# EAGLE board hw_LM (EAGLE 7.6.0), part 1 of 5
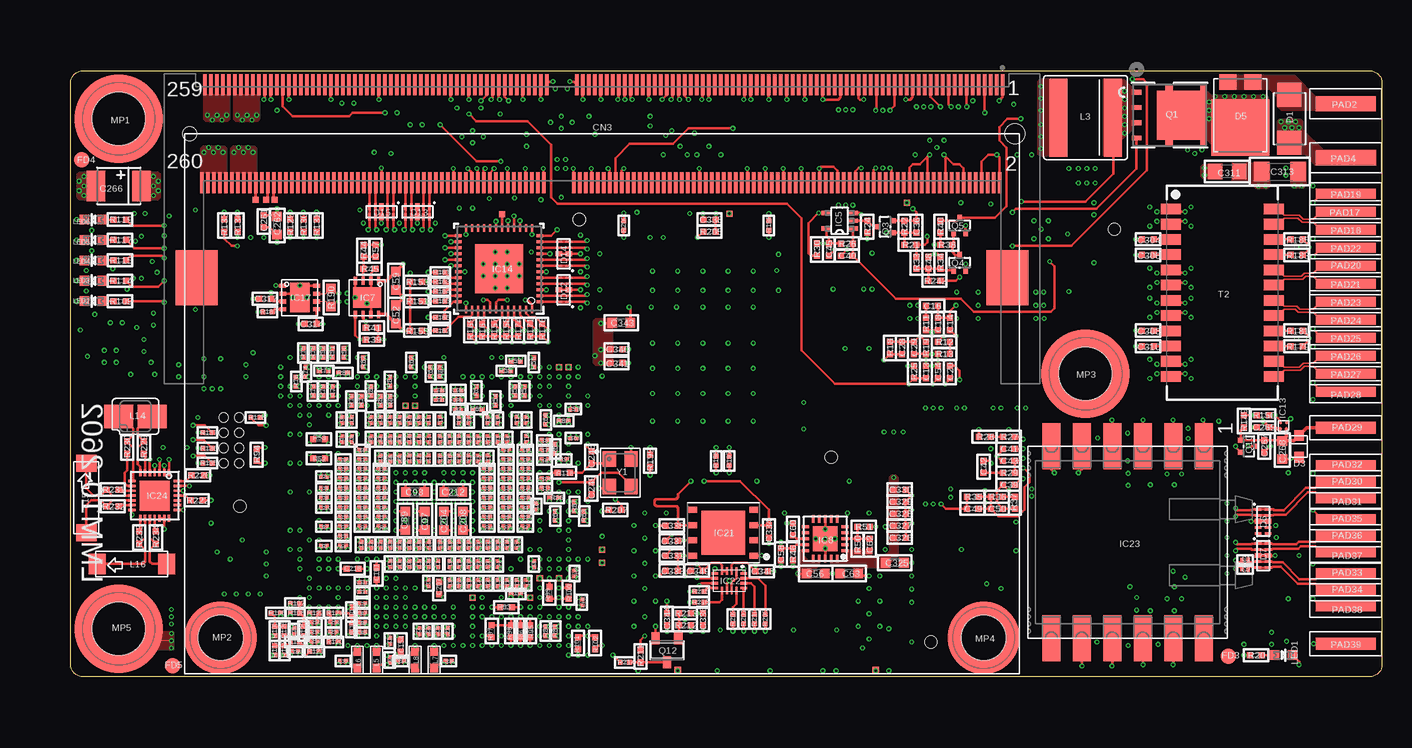
[diagram p13: board, top side]
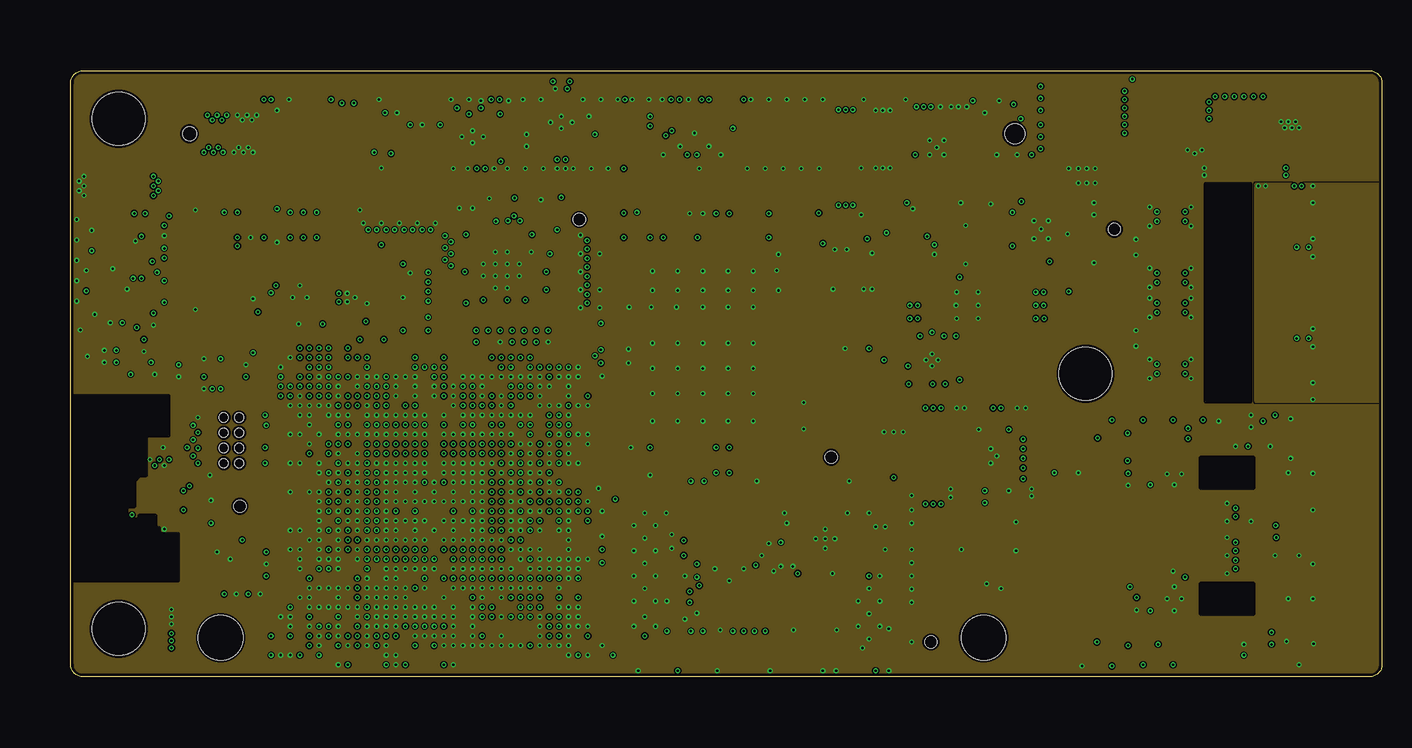
[diagram p14: board, inner layer GND2]
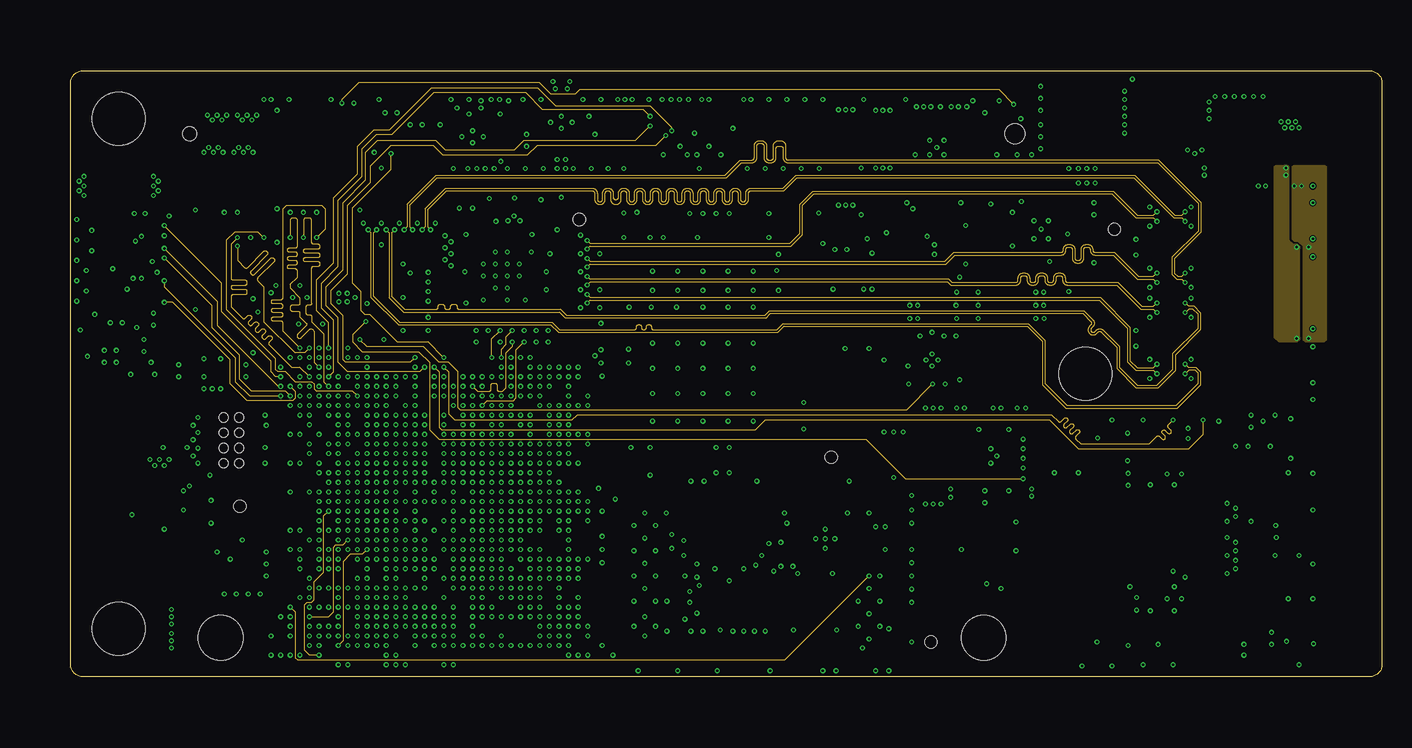
[diagram p15: board, inner layer S3]
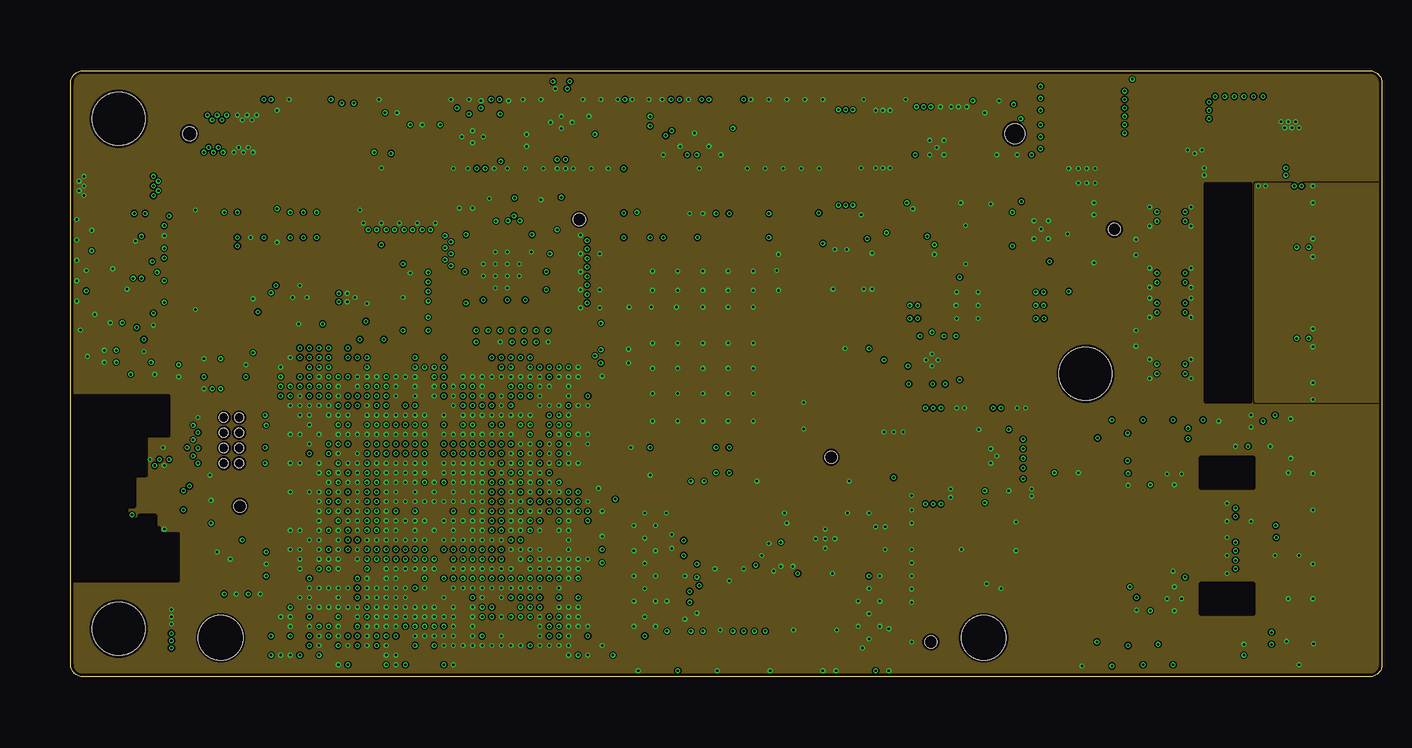
[diagram p16: board, inner layer GND4]
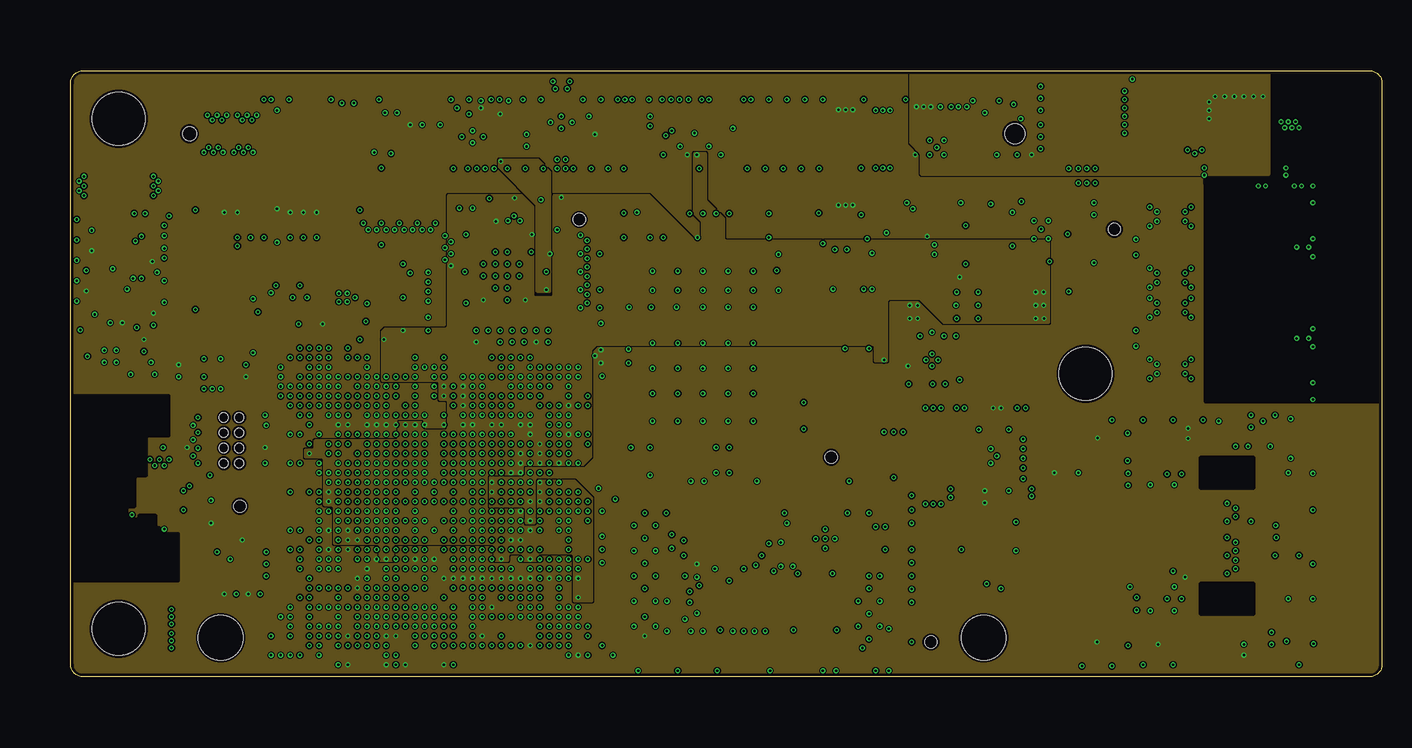
[diagram p17: board, inner layer PWR5]
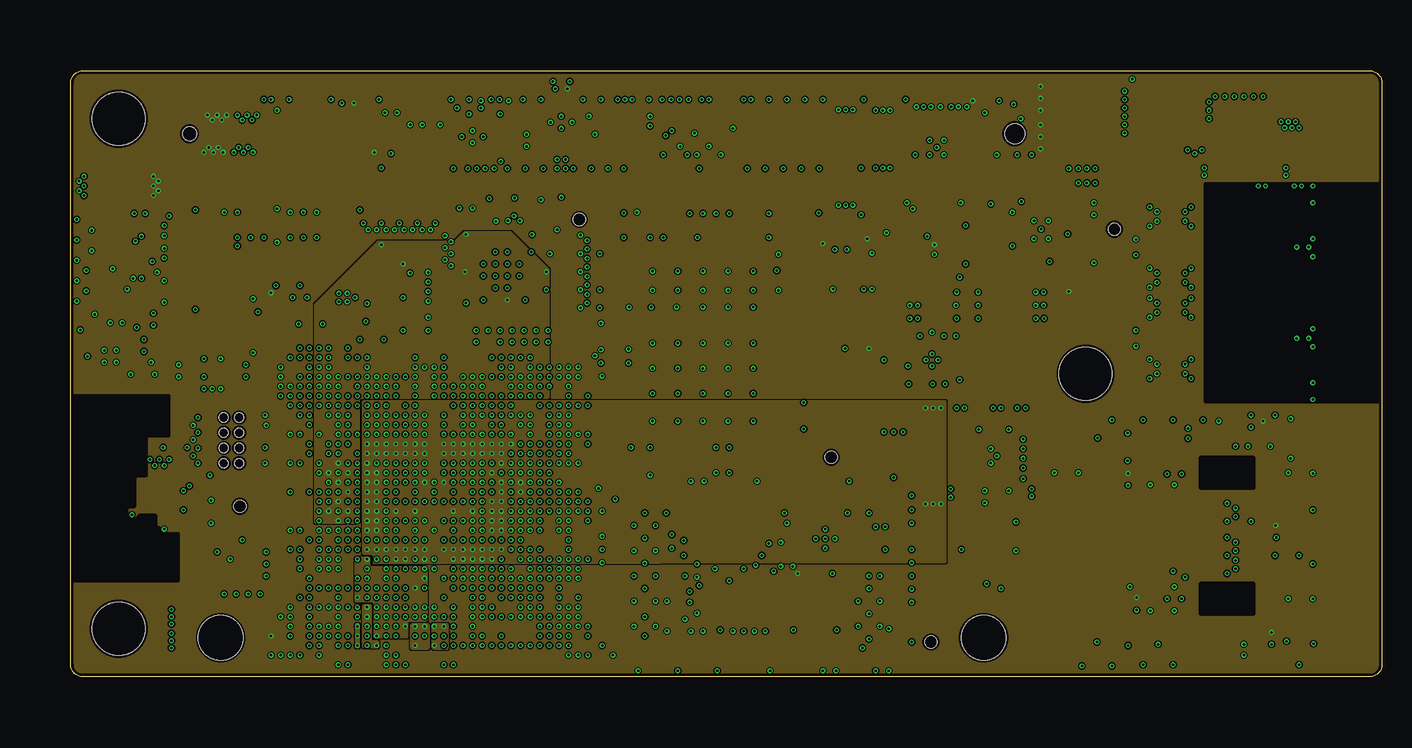
[diagram p18: board, inner layer PWR6]
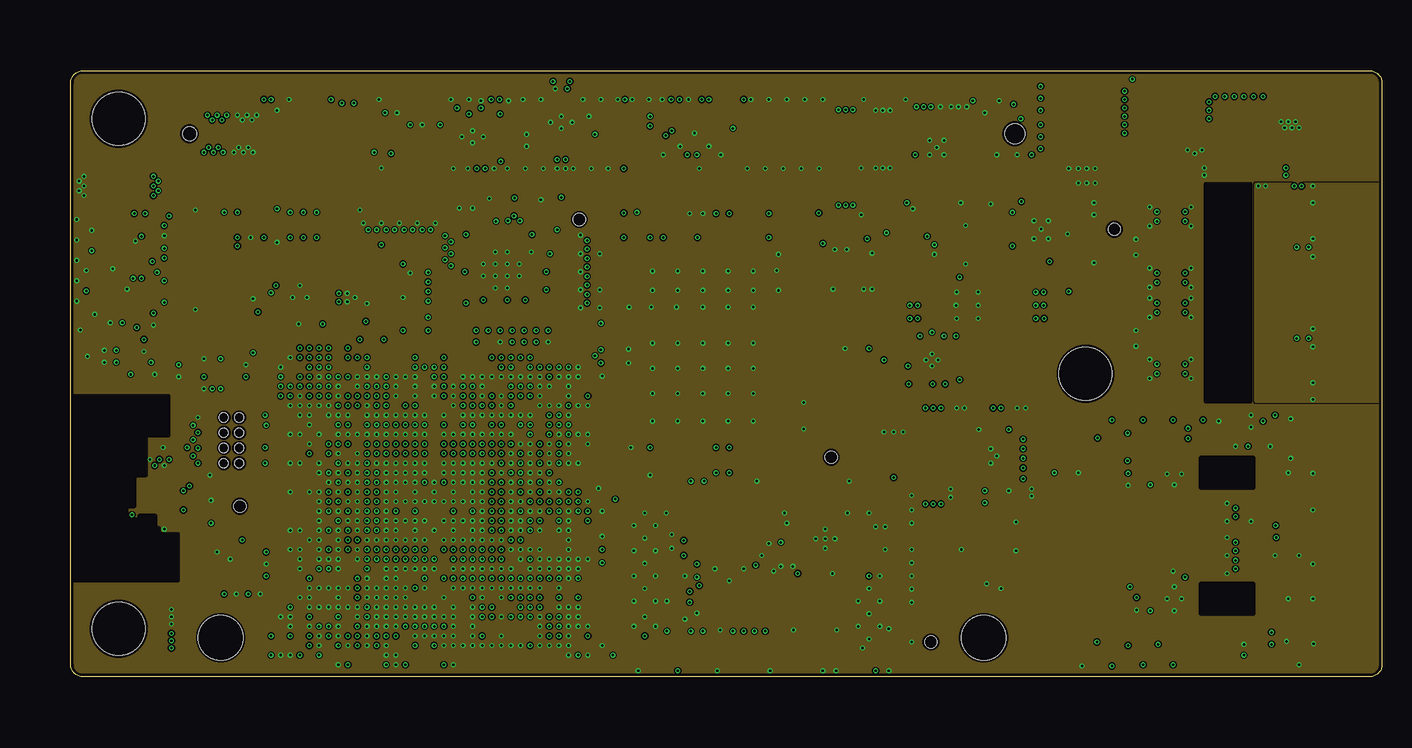
[diagram p19: board, inner layer GND7]
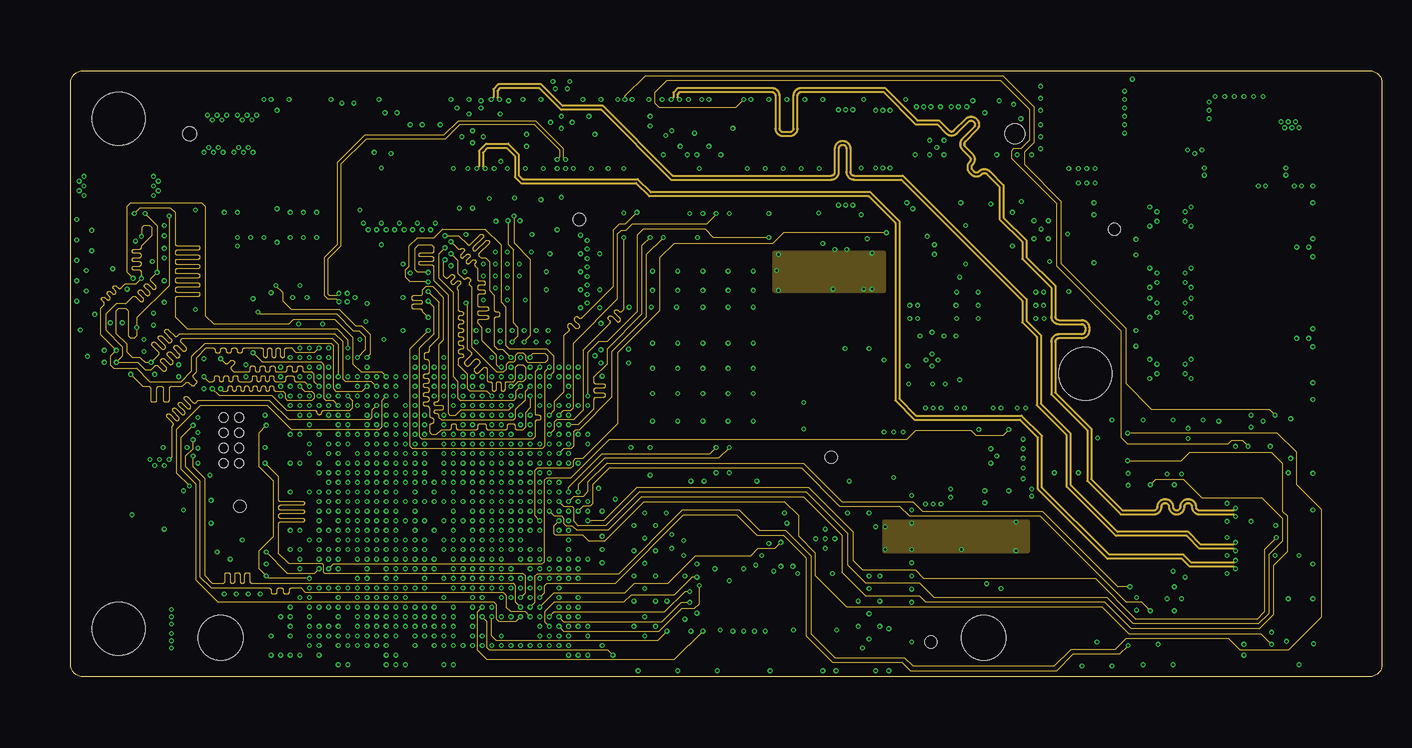
[diagram p20: board, inner layer S8]
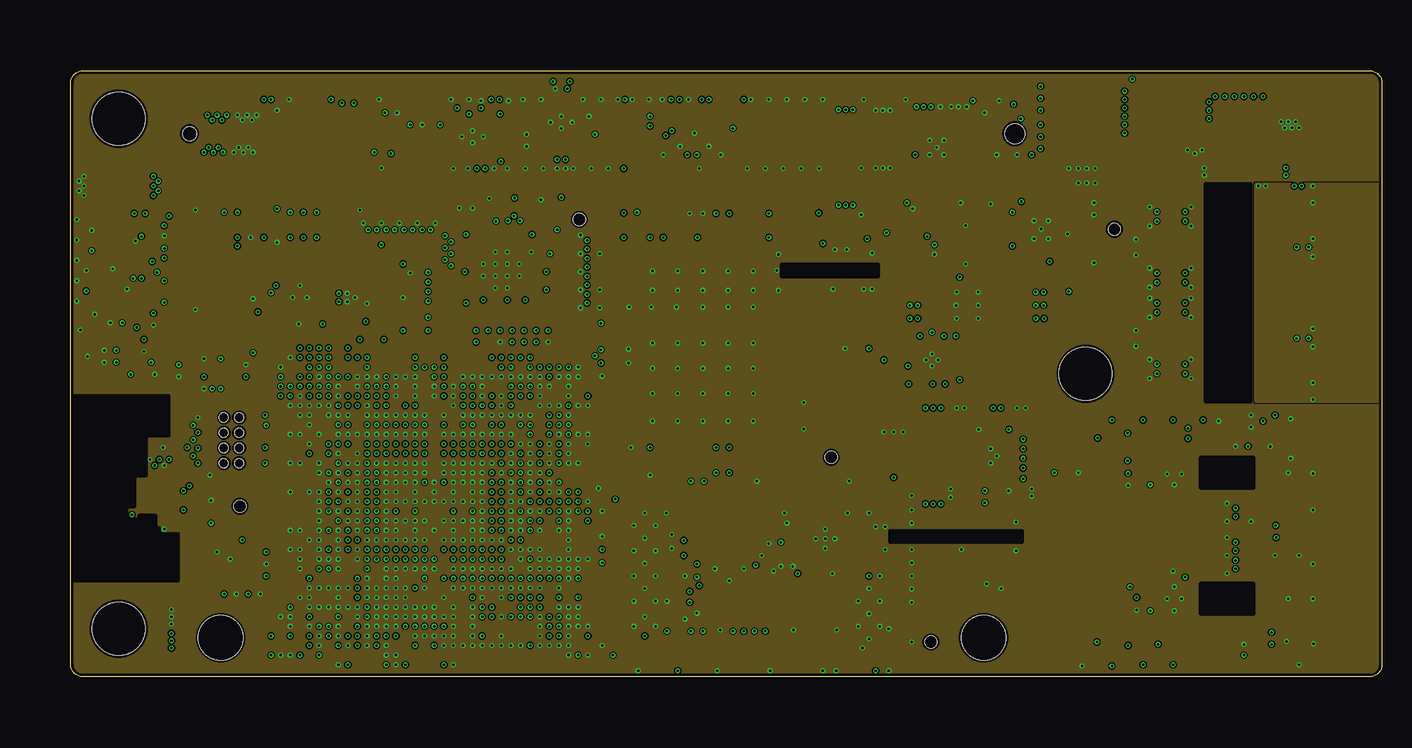
[diagram p21: board, inner layer GND9]
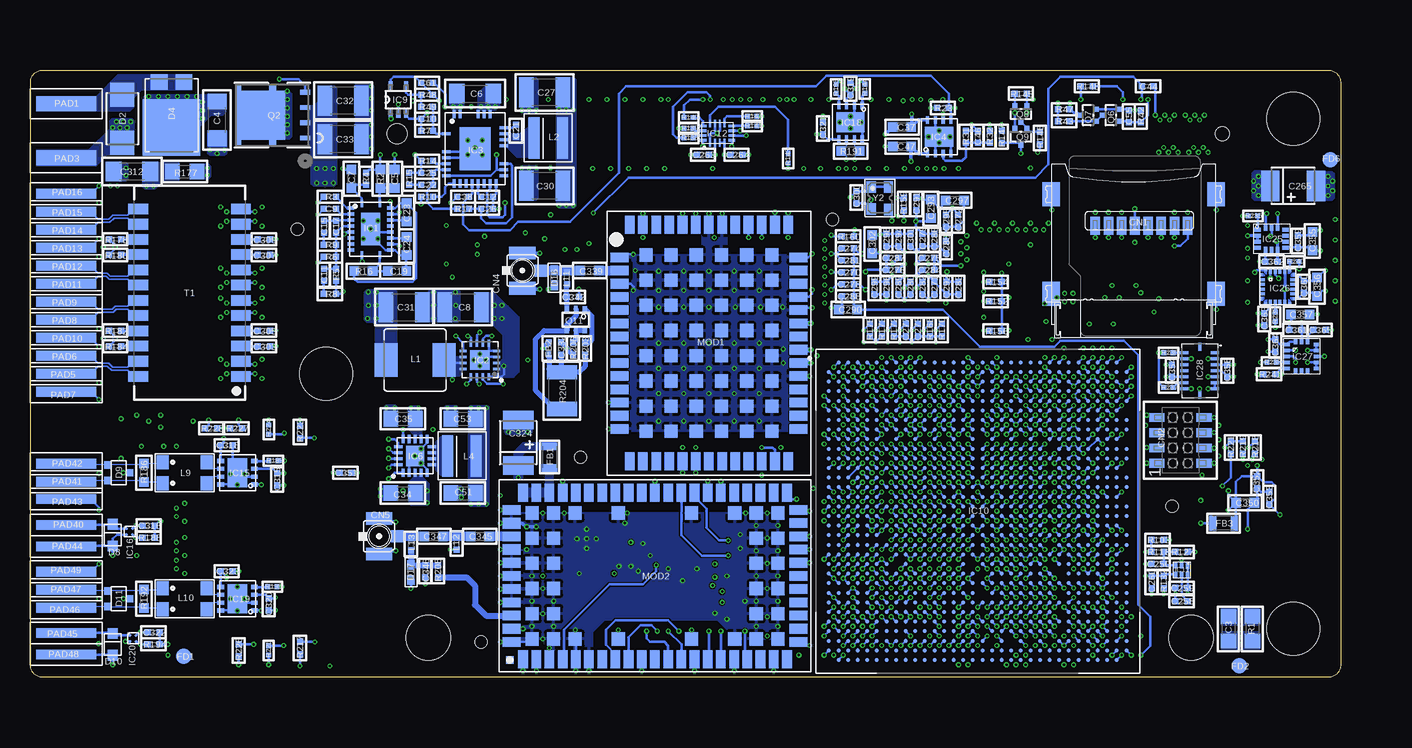
[diagram p22: board, bottom side, seen from below]

Size 109.3 x 50.5 mm. Coordinates in mm from the lower left corner, seen from the top.
Outline: 0,1 0,49.5 arc-90 1,50.5 108.3,50.5 arc-90 109.3,49.5 109.3,1 arc-90 108.3,0 1,0 arc-90 0,1
Copper layers (1+2*3+4*5+12*13+14*15+16): Top 0.017mm / dielectric 0.13mm / GND2 0.017mm / dielectric 10mil / S3 0.017mm / dielectric 0.13mm / GND4 0.017mm / dielectric 0.1mm / PWR5 0.017mm / dielectric 0.13mm / PWR6 0.017mm / dielectric 0.1mm / GND7 0.017mm / dielectric 0.13mm / S8 0.017mm / dielectric 10mil / GND9 0.017mm / dielectric 0.13mm / Bottom 0.017mm
Design rules "hw_LM": minimum track width 0.1mm, minimum drill 0.2mm, track to track 0.1mm, track to pad 0.1mm, pad to pad 0.1mm, via to via 0.1mm, smd to smd 0mil, copper to edge 0.2mm, drill to drill 0.3mm, minimum pad ring 0.15mm, minimum via ring 0.1mm, stop-mask expansion 0.05mm, vias tented up to drill 0.45mm, thermal gap 0.25mm
Net classes: 1 50R: width 0.1 mm, clearance 0.075 mm; 2 100R: width 0.1 mm, clearance 0.12 mm; 3 120R: width 0.1 mm, clearance 0.2 mm; 4 90R: width 0.155 mm, clearance 0.18 mm; 5 50R_INT: width 0.15 mm, clearance 0.075 mm; 6 50R_EXT: width 0.225 mm, clearance 0.1 mm; 7 50R_RF: width 0.8 mm, clearance 0.1 mm; 8 100R_INT: width 0.1 mm, clearance 0.12 mm; 9 100R_EXT: width 0.125 mm, clearance 0.125 mm; 10 90R_INT: width 0.155 mm, clearance 0.18 mm; 11 90R_EXT: width 0.2 mm, clearance 0.18 mm; 12 120R_INT: width 0.1 mm, clearance 0.2 mm; 13 120R_EXT: width 0.1 mm, clearance 0.195 mm
Holes 1 mm at 63.4,18.3 14.1,14.2 42.4,38.1 71.7,2.9 87,37.3

## Footprints (pad centres in the part's own frame; a part is rotated, then mirrored left to right if it is on the bottom)
C0201 = smd 0.3 x 0.4: 1 -0.254,0; 2 0.254,0
C0805 = smd 1.2 x 1.3: 1 -1.016,0; 2 1.016,0
C1206 = smd 1.3 x 1.6: 1 -1.524,0; 2 1.524,0
C0603 = smd 0.8 x 0.8: 1 -0.762,0; 2 0.762,0
C1210 = smd 1.2 x 2.5: 1 -1.524,0; 2 1.524,0
C0402 = smd 0.5 x 0.5: 1 -0.508,0; 2 0.508,0
TE-B-3528 = smd 1.524 x 2.54: + 1.905,0; - -1.905,0
SD-LATCH = smd 0.8 x 1.5: 1 3.3,0; 2 2.2,0; 3 1.1,0; 4 0,0; 5 -1.1,0; 6 -2.2,0; 7 -3.3,0; 8 -4.4,0 | smd 1.45 x 2: G1 6.97,-2.6; G2 6.97,5.7; G3 -6.78,5.7; G4 -6.78,-2.6
CLP-104-02-X-D-BE = smd 0.74 x 1.27: 1 -1.905,1.967; 2 -1.905,-1.967; 3 -0.635,1.967; 4 -0.635,-1.967; 5 0.635,1.967; 6 0.635,-1.967; 7 1.905,1.967; 8 1.905,-1.967 | hole 0.74: -0.635,0.635; 0.635,0.635; 1.905,0.635; -0.635,-0.635; 0.635,-0.635; 1.905,-0.635; -1.905,0.635; -1.905,-0.635
TE_2309409-1 = smd 0.3 x 1.75: 1 33.375,4.1; 2 33.125,-4.1; 3 32.875,4.1; 4 32.625,-4.1; 5 32.375,4.1; 6 32.125,-4.1; 7 31.875,4.1; 8 31.625,-4.1; 9 31.375,4.1; 10 31.125,-4.1; 11 30.875,4.1; 12 30.625,-4.1; 13 30.375,4.1; 14 30.125,-4.1; 15 29.875,4.1; 16 29.625,-4.1; 17 29.375,4.1; 18 29.125,-4.1; 19 28.875,4.1; 20 28.625,-4.1; 21 28.375,4.1; 22 28.125,-4.1; 23 27.875,4.1; 24 27.625,-4.1; 25 27.375,4.1; 26 27.125,-4.1; 27 26.875,4.1; 28 26.625,-4.1; 29 26.375,4.1; 30 26.125,-4.1; 31 25.875,4.1; 32 25.625,-4.1; 33 25.375,4.1; 34 25.125,-4.1; 35 24.875,4.1; 36 24.625,-4.1; 37 24.375,4.1; 38 24.125,-4.1; 39 23.875,4.1; 40 23.625,-4.1; 41 23.375,4.1; 42 23.125,-4.1; 43 22.875,4.1; 44 22.625,-4.1; 45 22.375,4.1; 46 22.125,-4.1; 47 21.875,4.1; 48 21.625,-4.1; 49 21.375,4.1; 50 21.125,-4.1; 51 20.875,4.1; 52 20.625,-4.1; 53 20.375,4.1; 54 20.125,-4.1; 55 19.875,4.1; 56 19.625,-4.1; 57 19.375,4.1; 58 19.125,-4.1; 59 18.875,4.1; 60 18.625,-4.1; 61 18.375,4.1; 62 18.125,-4.1; 63 17.875,4.1; 64 17.625,-4.1; 65 17.375,4.1; 66 17.125,-4.1; 67 16.875,4.1; 68 16.625,-4.1; 69 16.375,4.1; 70 16.125,-4.1; 71 15.875,4.1; 72 15.625,-4.1; 73 15.375,4.1; 74 15.125,-4.1; 75 14.875,4.1; 76 14.625,-4.1; 77 14.375,4.1; 78 14.125,-4.1; 79 13.875,4.1; 80 13.625,-4.1; 81 13.375,4.1; 82 13.125,-4.1; 83 12.875,4.1; 84 12.625,-4.1; 85 12.375,4.1; 86 12.125,-4.1; 87 11.875,4.1; 88 11.625,-4.1; 89 11.375,4.1; 90 11.125,-4.1; 91 10.875,4.1; 92 10.625,-4.1; 93 10.375,4.1; 94 10.125,-4.1; 95 9.875,4.1; 96 9.625,-4.1; 97 9.375,4.1; 98 9.125,-4.1; 99 8.875,4.1; 100 8.625,-4.1; 101 8.375,4.1; 102 8.125,-4.1; 103 7.875,4.1; 104 7.625,-4.1; 105 7.375,4.1; 106 7.125,-4.1; 107 6.875,4.1; 108 6.625,-4.1; 109 6.375,4.1; 110 6.125,-4.1; 111 5.875,4.1; 112 5.625,-4.1; 113 5.375,4.1; 114 5.125,-4.1; 115 4.875,4.1; 116 4.625,-4.1; 117 4.375,4.1; 118 4.125,-4.1; 119 3.875,4.1; 120 3.625,-4.1; 121 3.375,4.1; 122 3.125,-4.1; 123 2.875,4.1; 124 2.625,-4.1; 125 2.375,4.1; 126 2.125,-4.1; 127 1.875,4.1; 128 1.625,-4.1; 129 1.375,4.1; 130 1.125,-4.1; 131 0.875,4.1; 132 0.625,-4.1; 133 0.375,4.1; 134 0.125,-4.1; 135 -0.125,4.1; 136 -0.375,-4.1; 137 -0.625,4.1; 138 -0.875,-4.1; 139 -1.125,4.1; 140 -1.375,-4.1; 141 -1.625,4.1; 142 -1.875,-4.1; 143 -2.125,4.1; 144 -2.375,-4.1; 145 -4.625,4.1; 146 -4.875,-4.1; 147 -5.125,4.1; 148 -5.375,-4.1; 149 -5.625,4.1; 150 -5.875,-4.1; 151 -6.125,4.1; 152 -6.375,-4.1; 153 -6.625,4.1; 154 -6.875,-4.1; 155 -7.125,4.1; 156 -7.375,-4.1; 157 -7.625,4.1; 158 -7.875,-4.1; 159 -8.125,4.1; 160 -8.375,-4.1; 161 -8.625,4.1; 162 -8.875,-4.1; 163 -9.125,4.1; 164 -9.375,-4.1; 165 -9.625,4.1; 166 -9.875,-4.1; 167 -10.125,4.1; 168 -10.375,-4.1; 169 -10.625,4.1; 170 -10.875,-4.1; 171 -11.125,4.1; 172 -11.375,-4.1; 173 -11.625,4.1; 174 -11.875,-4.1; 175 -12.125,4.1; 176 -12.375,-4.1; 177 -12.625,4.1; 178 -12.875,-4.1; 179 -13.125,4.1; 180 -13.375,-4.1; 181 -13.625,4.1; 182 -13.875,-4.1; 183 -14.125,4.1; 184 -14.375,-4.1; 185 -14.625,4.1; 186 -14.875,-4.1; 187 -15.125,4.1; 188 -15.375,-4.1; 189 -15.625,4.1; 190 -15.875,-4.1; 191 -16.125,4.1; 192 -16.375,-4.1; 193 -16.625,4.1; 194 -16.875,-4.1; 195 -17.125,4.1; 196 -17.375,-4.1; 197 -17.625,4.1; 198 -17.875,-4.1; 199 -18.125,4.1; 200 -18.375,-4.1; 201 -18.625,4.1; 202 -18.875,-4.1; 203 -19.125,4.1; 204 -19.375,-4.1; 205 -19.625,4.1; 206 -19.875,-4.1; 207 -20.125,4.1; 208 -20.375,-4.1; 209 -20.625,4.1; 210 -20.875,-4.1; 211 -21.125,4.1; 212 -21.375,-4.1; 213 -21.625,4.1; 214 -21.875,-4.1; 215 -22.125,4.1; 216 -22.375,-4.1; 217 -22.625,4.1; 218 -22.875,-4.1; 219 -23.125,4.1; 220 -23.375,-4.1; 221 -23.625,4.1; 222 -23.875,-4.1; 223 -24.125,4.1; 224 -24.375,-4.1; 225 -24.625,4.1; 226 -24.875,-4.1; 227 -25.125,4.1; 228 -25.375,-4.1; 229 -25.625,4.1; 230 -25.875,-4.1; 231 -26.125,4.1; 232 -26.375,-4.1; 233 -26.625,4.1; 234 -26.875,-4.1; 235 -27.125,4.1; 236 -27.375,-4.1; 237 -27.625,4.1; 238 -27.875,-4.1; 239 -28.125,4.1; 240 -28.375,-4.1; 241 -28.625,4.1; 242 -28.875,-4.1; 243 -29.125,4.1; 244 -29.375,-4.1; 245 -29.625,4.1; 246 -29.875,-4.1; 247 -30.125,4.1; 248 -30.375,-4.1; 249 -30.625,4.1; 250 -30.875,-4.1; 251 -31.125,4.1; 252 -31.375,-4.1; 253 -31.625,4.1; 254 -31.875,-4.1; 255 -32.125,4.1; 256 -32.375,-4.1; 257 -32.625,4.1; 258 -32.875,-4.1; 259 -33.125,4.1; 260 -33.375,-4.1 | smd 3.5 x 4.6: S1 33.8,-12; S2 -33.8,-12 | hole 1.65: 34.4,0 | hole 1.15: -34.4,0
U.FL-R-SMT-1 = smd 1.05 x 2.2: GND1 1.475,0; GND2 -1.475,0 | smd 1 x 1.05: SIG 0,-1.525
SMA_BI = smd 2 x 2: 1 -2,0; 2 2,0
SOD-323 = smd 0.9 x 0.8: A 0.9,0; K -0.9,0
TO-277A-3 = smd 1.4 x 1.27: A1 -1.04,-2.765; A2 1.04,-2.765 | smd 4.8 x 4.72: K 0,1.04
DQA(R-PUSON-N10) = smd 0.2 x 0.565: 1 -1,-0.417; 2 -0.5,-0.417; 4 0.5,-0.417; 5 1,-0.417; 6 1,0.417; 7 0.5,0.417; 9 -0.5,0.417; 10 -1,0.417 | smd 0.4 x 0.565: 3 0,-0.417; 8 0,0.417
SOT323-3 = smd 0.6 x 0.55: 1 -0.65,-0.925; 2 0.65,-0.925; 3 0,0.925
PESD0402-140 = smd 0.8 x 0.6: P$1 -0.625,0; P$2 0.625,0
L0805 = smd 0.6 x 1.25: 1 -0.9,0; 2 0.9,0
L0402 = smd 0.5 x 0.5: 1 -0.508,0; 2 0.508,0
FIDU = smd 1.3 x 1.3: P$1 0,0
VQFN-20 = smd 0.25 x 0.6: 1 -0.75,2.15; 10 -0.75,-2.15; 11 0.75,-2.15; 20 0.75,2.15 | smd 0.6 x 0.25: 2 -1.65,1.75; 3 -1.65,1.25; 4 -1.65,0.75; 5 -1.65,0.25; 6 -1.65,-0.25; 7 -1.65,-0.75; 8 -1.65,-1.25; 9 -1.65,-1.75; 12 1.65,-1.75; 13 1.65,-1.25; 14 1.65,-0.75; 15 1.65,-0.25; 16 1.65,0.25; 17 1.65,0.75; 18 1.65,1.25; 19 1.65,1.75 | smd 1.7 x 2.7: 21 0,0
WQFN-16 = smd 0.6 x 0.24: 1 -1.4,0.75; 2 -1.4,0.25; 3 -1.4,-0.25; 4 -1.4,-0.75; 9 1.4,-0.75; 10 1.4,-0.25; 11 1.4,0.25; 12 1.4,0.75 | smd 0.24 x 0.6: 5 -0.75,-1.4; 6 -0.25,-1.4; 7 0.25,-1.4; 8 0.75,-1.4; 13 0.75,1.4; 14 0.25,1.4; 15 -0.25,1.4; 16 -0.75,1.4 | smd 1.6 x 1.6: EP 0,0
UHE36(26) = smd 0.25 x 0.7: 3 -1.25,-2.4; 6 0.25,-2.4; 7 0.75,-2.4; 8 1.25,-2.4; 9 1.75,-2.4; 10 2.25,-2.4; 19 2.25,2.4; 20 1.75,2.4; 21 1.25,2.4; 24 -0.25,2.4; 25 -0.75,2.4; 26 -1.25,2.4; 27 -1.75,2.4 | smd 0.7 x 0.25: 11 2.9,-1.75; 12 2.9,-1.25; 13 2.9,-0.75; 14 2.9,-0.25; 15 2.9,0.25; 16 2.9,0.75; 17 2.9,1.25; 18 2.9,1.75; 30 -2.9,1.25; 31 -2.9,0.75; 32 -2.9,0.25; 35 -2.9,-1.25; 36 -2.9,-1.75 | smd 3.6 x 2.6: 37 0,0
VSON-8 = smd 0.6 x 0.31: 1 -1.4,0.975; 2 -1.4,0.325; 3 -1.4,-0.325; 4 -1.4,-0.975; 5 1.4,-0.975; 6 1.4,-0.325; 7 1.4,0.325; 8 1.4,0.975 | smd 1.65 x 2.4: 9 0,0
DCK5 = smd 0.85 x 0.35: 1 -1.1,0.65; 2 -1.1,0; 3 -1.1,-0.65; 4 1.1,-0.65; 5 1.1,0.65
LQFN-18 = smd 0.7 x 0.25: 1 -1.4,1; 2 -1.4,0.5; 3 -1.4,0; 4 -1.4,-0.5; 5 -1.4,-1; 10 1.4,-1; 11 1.4,-0.5; 12 1.4,0; 13 1.4,0.5; 14 1.4,1 | smd 0.25 x 0.7: 6 -0.75,-1.4; 7 -0.25,-1.4; 8 0.25,-1.4; 9 0.75,-1.4; 15 0.75,1.4; 16 0.25,1.4; 17 -0.25,1.4; 18 -0.75,1.4 | smd 1.7 x 1.51: 19 0,0
VQFN-20(TEXAS) = smd 0.6 x 0.24: 1 -1.65,1; 2 -1.65,0.5; 3 -1.65,0; 4 -1.65,-0.5; 5 -1.65,-1; 11 1.65,-1; 12 1.65,-0.5; 13 1.65,0; 14 1.65,0.5; 15 1.65,1 | smd 0.24 x 0.6: 6 -1,-1.65; 7 -0.5,-1.65; 8 0,-1.65; 9 0.5,-1.65; 10 1,-1.65; 16 1,1.65; 17 0.5,1.65; 18 0,1.65; 19 -0.5,1.65; 20 -1,1.65 | smd 2.05 x 2.05: 21 0,0
IC_S32E288AACAAMJGR = smd 0.34 x 0.34: A2 -11.6,12.4; A3 -10.8,12.4; A4 -10,12.4; A5 -9.2,12.4; A6 -8.4,12.4; A7 -7.6,12.4; A8 -6.8,12.4; A9 -6,12.4; A10 -5.2,12.4; A11 -4.4,12.4; A12 -3.6,12.4; A13 -2.8,12.4; A14 -2,12.4; A15 -1.2,12.4; A16 -0.4,12.4; A17 0.4,12.4; A18 1.2,12.4; A19 2,12.4; A20 2.8,12.4; A21 3.6,12.4; A22 4.4,12.4; A23 5.2,12.4; A24 6,12.4; A25 6.8,12.4; A26 7.6,12.4; A27 8.4,12.4; A28 9.2,12.4; A29 10,12.4; A30 10.8,12.4; A31 11.6,12.4; AA1 -12.4,-3.6; AA2 -11.6,-3.6; AA3 -10.8,-3.6; AA4 -10,-3.6; AA5 -9.2,-3.6; AA6 -8.4,-3.6; AA8 -6.8,-3.6; AA9 -6,-3.6; AA10 -5.2,-3.6; AA11 -4.4,-3.6; AA12 -3.6,-3.6; AA13 -2.8,-3.6; AA14 -2,-3.6; AA15 -1.2,-3.6; AA16 -0.4,-3.6; AA17 0.4,-3.6; AA18 1.2,-3.6; AA19 2,-3.6; AA20 2.8,-3.6; AA21 3.6,-3.6; AA22 4.4,-3.6; AA23 5.2,-3.6; AA24 6,-3.6; AA25 6.8,-3.6; AA26 7.6,-3.6; AA27 8.4,-3.6; AA28 9.2,-3.6; AA29 10,-3.6; AA30 10.8,-3.6; AA31 11.6,-3.6; AB1 -12.4,-4.4; AB2 -11.6,-4.4; AB3 -10.8,-4.4; AB4 -10,-4.4; AB5 -9.2,-4.4; AB6 -8.4,-4.4; AB7 -7.6,-4.4; AB9 -6,-4.4; AB11 -4.4,-4.4; AB13 -2.8,-4.4; AB15 -1.2,-4.4; AB17 0.4,-4.4; AB18 1.2,-4.4; AB19 2,-4.4; AB20 2.8,-4.4; AB21 3.6,-4.4; AB22 4.4,-4.4; AB23 5.2,-4.4; AB25 6.8,-4.4; AB26 7.6,-4.4; AB27 8.4,-4.4; AB28 9.2,-4.4; AB29 10,-4.4; AB30 10.8,-4.4; AB31 11.6,-4.4; AB32 12.4,-4.4; AC1 -12.4,-5.2; AC2 -11.6,-5.2; AC3 -10.8,-5.2; AC4 -10,-5.2; AC5 -9.2,-5.2; AC6 -8.4,-5.2; AC7 -7.6,-5.2; AC8 -6.8,-5.2; AC9 -6,-5.2; AC10 -5.2,-5.2; AC11 -4.4,-5.2; AC12 -3.6,-5.2; AC13 -2.8,-5.2; AC14 -2,-5.2; AC15 -1.2,-5.2; AC16 -0.4,-5.2; AC18 1.2,-5.2; AC19 2,-5.2; AC20 2.8,-5.2; AC21 3.6,-5.2; AC22 4.4,-5.2; AC23 5.2,-5.2; AC24 6,-5.2; AC26 7.6,-5.2; AC27 8.4,-5.2; AC28 9.2,-5.2; AC29 10,-5.2; AC30 10.8,-5.2; AC31 11.6,-5.2; AC32 12.4,-5.2; AD1 -12.4,-6; AD2 -11.6,-6; AD3 -10.8,-6; AD4 -10,-6; AD5 -9.2,-6; AD6 -8.4,-6; AD7 -7.6,-6; AD8 -6.8,-6; AD9 -6,-6; AD10 -5.2,-6; AD11 -4.4,-6; AD12 -3.6,-6; AD13 -2.8,-6; AD14 -2,-6; AD15 -1.2,-6; AD16 -0.4,-6; AD17 0.4,-6; AD18 1.2,-6; AD19 2,-6; AD20 2.8,-6; AD21 3.6,-6; AD22 4.4,-6; AD23 5.2,-6; AD24 6,-6; AD25 6.8,-6; AD26 7.6,-6; AD27 8.4,-6; AD28 9.2,-6; AD29 10,-6; AD30 10.8,-6; AD31 11.6,-6; AD32 12.4,-6; AE1 -12.4,-6.8; AE2 -11.6,-6.8; AE3 -10.8,-6.8; AE4 -10,-6.8; AE5 -9.2,-6.8; AE6 -8.4,-6.8; AE7 -7.6,-6.8; AE8 -6.8,-6.8; AE9 -6,-6.8; AE10 -5.2,-6.8; AE11 -4.4,-6.8; AE12 -3.6,-6.8; AE13 -2.8,-6.8; AE14 -2,-6.8; AE15 -1.2,-6.8; AE16 -0.4,-6.8; AE18 1.2,-6.8; AE19 2,-6.8; AE20 2.8,-6.8; AE21 3.6,-6.8; AE22 4.4,-6.8; AE23 5.2,-6.8; AE24 6,-6.8; AE26 7.6,-6.8; AE27 8.4,-6.8; AE28 9.2,-6.8; AE29 10,-6.8; AE30 10.8,-6.8; AE31 11.6,-6.8; AE32 12.4,-6.8; AF1 -12.4,-7.6; AF2 -11.6,-7.6; AF3 -10.8,-7.6; AF4 -10,-7.6; AF5 -9.2,-7.6; AF6 -8.4,-7.6; AF7 -7.6,-7.6; AF8 -6.8,-7.6; AF9 -6,-7.6; AF10 -5.2,-7.6; AF11 -4.4,-7.6; AF12 -3.6,-7.6; AF13 -2.8,-7.6; AF14 -2,-7.6; AF15 -1.2,-7.6; AF16 -0.4,-7.6; AF17 0.4,-7.6; AF18 1.2,-7.6; AF19 2,-7.6; AF20 2.8,-7.6; AF21 3.6,-7.6; AF22 4.4,-7.6; AF23 5.2,-7.6; AF24 6,-7.6; AF25 6.8,-7.6; AF26 7.6,-7.6; AF27 8.4,-7.6; AF28 9.2,-7.6; AF29 10,-7.6; AF30 10.8,-7.6; AF31 11.6,-7.6; AF32 12.4,-7.6; AG1 -12.4,-8.4; AG2 -11.6,-8.4; AG3 -10.8,-8.4; AG4 -10,-8.4; AG5 -9.2,-8.4; AG6 -8.4,-8.4; AG7 -7.6,-8.4; AG8 -6.8,-8.4; AG9 -6,-8.4; AG10 -5.2,-8.4; AG11 -4.4,-8.4; AG12 -3.6,-8.4; AG13 -2.8,-8.4; AG14 -2,-8.4; AG15 -1.2,-8.4; AG16 -0.4,-8.4; AG18 1.2,-8.4; AG19 2,-8.4; AG20 2.8,-8.4; AG21 3.6,-8.4; AG22 4.4,-8.4; AG23 5.2,-8.4; AG24 6,-8.4; AG26 7.6,-8.4; AG27 8.4,-8.4; AG28 9.2,-8.4; AG29 10,-8.4; AG30 10.8,-8.4; AG31 11.6,-8.4; AG32 12.4,-8.4; AH1 -12.4,-9.2; AH2 -11.6,-9.2; AH3 -10.8,-9.2; AH4 -10,-9.2; AH5 -9.2,-9.2; AH6 -8.4,-9.2; AH7 -7.6,-9.2; AH8 -6.8,-9.2; AH9 -6,-9.2; AH10 -5.2,-9.2; AH11 -4.4,-9.2; AH12 -3.6,-9.2; AH13 -2.8,-9.2; AH14 -2,-9.2; AH15 -1.2,-9.2; AH16 -0.4,-9.2; AH17 0.4,-9.2; AH18 1.2,-9.2; AH19 2,-9.2; AH20 2.8,-9.2; AH21 3.6,-9.2; AH22 4.4,-9.2; AH23 5.2,-9.2; AH24 6,-9.2; AH25 6.8,-9.2; AH26 7.6,-9.2; AH27 8.4,-9.2; AH28 9.2,-9.2; AH29 10,-9.2; AH30 10.8,-9.2; AH31 11.6,-9.2; AH32 12.4,-9.2; AJ1 -12.4,-10; AJ2 -11.6,-10; AJ3 -10.8,-10; AJ4 -10,-10; AJ5 -9.2,-10; AJ6 -8.4,-10; AJ7 -7.6,-10; AJ8 -6.8,-10; AJ9 -6,-10; AJ10 -5.2,-10; AJ11 -4.4,-10; AJ12 -3.6,-10; AJ13 -2.8,-10; AJ14 -2,-10; AJ15 -1.2,-10; AJ16 -0.4,-10; AJ18 1.2,-10; AJ19 2,-10; AJ20 2.8,-10; AJ21 3.6,-10; AJ22 4.4,-10; AJ23 5.2,-10; AJ24 6,-10; AJ26 7.6,-10; AJ27 8.4,-10; AJ28 9.2,-10; AJ29 10,-10; AJ30 10.8,-10; AJ31 11.6,-10; AJ32 12.4,-10; AK1 -12.4,-10.8; AK2 -11.6,-10.8; AK3 -10.8,-10.8; AK4 -10,-10.8; AK5 -9.2,-10.8; AK6 -8.4,-10.8; AK7 -7.6,-10.8; AK8 -6.8,-10.8; AK9 -6,-10.8; AK10 -5.2,-10.8; AK11 -4.4,-10.8; AK12 -3.6,-10.8; AK13 -2.8,-10.8; AK14 -2,-10.8; AK15 -1.2,-10.8; AK16 -0.4,-10.8; AK17 0.4,-10.8; AK19 2,-10.8; AK21 3.6,-10.8; AK23 5.2,-10.8; AK25 6.8,-10.8; AK26 7.6,-10.8; AK27 8.4,-10.8; AK28 9.2,-10.8; AK29 10,-10.8; AK30 10.8,-10.8; AK31 11.6,-10.8; AK32 12.4,-10.8; AL1 -12.4,-11.6; AL2 -11.6,-11.6; AL3 -10.8,-11.6; AL4 -10,-11.6; AL5 -9.2,-11.6; AL6 -8.4,-11.6; AL7 -7.6,-11.6; AL8 -6.8,-11.6; AL9 -6,-11.6; AL10 -5.2,-11.6; AL11 -4.4,-11.6; AL12 -3.6,-11.6; AL13 -2.8,-11.6; AL14 -2,-11.6; AL15 -1.2,-11.6; AL16 -0.4,-11.6; AL17 0.4,-11.6; AL18 1.2,-11.6; AL19 2,-11.6; AL20 2.8,-11.6; AL21 3.6,-11.6; AL22 4.4,-11.6; AL23 5.2,-11.6; AL24 6,-11.6; AL25 6.8,-11.6; AL26 7.6,-11.6; AL27 8.4,-11.6; AL28 9.2,-11.6; AL29 10,-11.6; AL30 10.8,-11.6; AL31 11.6,-11.6; AL32 12.4,-11.6; AM2 -11.6,-12.4; AM3 -10.8,-12.4; AM4 -10,-12.4; AM5 -9.2,-12.4; AM6 -8.4,-12.4; AM7 -7.6,-12.4; AM8 -6.8,-12.4; AM9 -6,-12.4; AM10 -5.2,-12.4; AM11 -4.4,-12.4; AM12 -3.6,-12.4; AM13 -2.8,-12.4; AM14 -2,-12.4; AM15 -1.2,-12.4; AM16 -0.4,-12.4; AM17 0.4,-12.4; AM18 1.2,-12.4; AM19 2,-12.4; AM20 2.8,-12.4; AM21 3.6,-12.4; AM22 4.4,-12.4; AM23 5.2,-12.4; AM24 6,-12.4; AM25 6.8,-12.4; AM26 7.6,-12.4; AM27 8.4,-12.4; AM28 9.2,-12.4; AM29 10,-12.4; AM30 10.8,-12.4; AM31 11.6,-12.4; B1 -12.4,11.6; B2 -11.6,11.6; B3 -10.8,11.6; B4 -10,11.6; B5 -9.2,11.6; B6 -8.4,11.6; B7 -7.6,11.6; B8 -6.8,11.6; B9 -6,11.6; B10 -5.2,11.6; B11 -4.4,11.6; B12 -3.6,11.6; B13 -2.8,11.6; B14 -2,11.6; B15 -1.2,11.6; B16 -0.4,11.6; B17 0.4,11.6; B18 1.2,11.6; B19 2,11.6; B20 2.8,11.6; B21 3.6,11.6; B22 4.4,11.6; B23 5.2,11.6; B24 6,11.6; B25 6.8,11.6; B26 7.6,11.6; B27 8.4,11.6; B28 9.2,11.6; B29 10,11.6; B30 10.8,11.6; B31 11.6,11.6; B32 12.4,11.6; C1 -12.4,10.8; C2 -11.6,10.8; C3 -10.8,10.8; C4 -10,10.8; C5 -9.2,10.8; C6 -8.4,10.8; C7 -7.6,10.8; C8 -6.8,10.8; C9 -6,10.8; C10 -5.2,10.8; C11 -4.4,10.8; C12 -3.6,10.8; C13 -2.8,10.8; C14 -2,10.8; C15 -1.2,10.8; C16 -0.4,10.8; C17 0.4,10.8; C18 1.2,10.8; C19 2,10.8; C20 2.8,10.8; C21 3.6,10.8; C22 4.4,10.8; C23 5.2,10.8; C24 6,10.8; C25 6.8,10.8; C26 7.6,10.8; C27 8.4,10.8; C28 9.2,10.8; C29 10,10.8; C30 10.8,10.8; C31 11.6,10.8; C32 12.4,10.8; D1 -12.4,10; D2 -11.6,10; D3 -10.8,10; D4 -10,10; D5 -9.2,10; D6 -8.4,10; D7 -7.6,10; D8 -6.8,10; D9 -6,10; D10 -5.2,10; D11 -4.4,10; D12 -3.6,10; D13 -2.8,10; D14 -2,10; D15 -1.2,10; D16 -0.4,10; D17 0.4,10; D18 1.2,10; D19 2,10; D20 2.8,10; D21 3.6,10; D22 4.4,10; D23 5.2,10; D24 6,10; D25 6.8,10; D26 7.6,10; D27 8.4,10; D28 9.2,10; D29 10,10; D30 10.8,10; D31 11.6,10; D32 12.4,10; E1 -12.4,9.2; E2 -11.6,9.2; E3 -10.8,9.2; E4 -10,9.2; E5 -9.2,9.2; E6 -8.4,9.2; E7 -7.6,9.2; E8 -6.8,9.2; E9 -6,9.2; E10 -5.2,9.2; E11 -4.4,9.2; E12 -3.6,9.2; E13 -2.8,9.2; E14 -2,9.2; E15 -1.2,9.2; E16 -0.4,9.2; E17 0.4,9.2; E18 1.2,9.2; E19 2,9.2; E20 2.8,9.2; E21 3.6,9.2; E22 4.4,9.2; E23 5.2,9.2; E24 6,9.2; E25 6.8,9.2; E26 7.6,9.2; E27 8.4,9.2; E28 9.2,9.2; E29 10,9.2; E30 10.8,9.2; E31 11.6,9.2; E32 12.4,9.2; F1 -12.4,8.4; F2 -11.6,8.4; F3 -10.8,8.4; F4 -10,8.4; F5 -9.2,8.4; F6 -8.4,8.4; F7 -7.6,8.4; F8 -6.8,8.4; F9 -6,8.4; F10 -5.2,8.4; F11 -4.4,8.4; F12 -3.6,8.4; F13 -2.8,8.4; F14 -2,8.4; F15 -1.2,8.4; F16 -0.4,8.4; F17 0.4,8.4; F18 1.2,8.4; F19 2,8.4; F20 2.8,8.4; F21 3.6,8.4; F22 4.4,8.4; F23 5.2,8.4; F24 6,8.4; F25 6.8,8.4; F26 7.6,8.4; F27 8.4,8.4; F28 9.2,8.4; F29 10,8.4; F30 10.8,8.4; F31 11.6,8.4; G1 -12.4,7.6; G2 -11.6,7.6; G3 -10.8,7.6; G4 -10,7.6; G5 -9.2,7.6; G6 -8.4,7.6; G7 -7.6,7.6; G8 -6.8,7.6; G9 -6,7.6; G10 -5.2,7.6; G11 -4.4,7.6; G12 -3.6,7.6; G13 -2.8,7.6; G14 -2,7.6; G15 -1.2,7.6; G16 -0.4,7.6; G17 0.4,7.6; G18 1.2,7.6; G19 2,7.6; G20 2.8,7.6; G21 3.6,7.6; G22 4.4,7.6; G23 5.2,7.6; G24 6,7.6; G25 6.8,7.6; G26 7.6,7.6; G27 8.4,7.6; G28 9.2,7.6; G29 10,7.6; G30 10.8,7.6; G31 11.6,7.6; G32 12.4,7.6; H1 -12.4,6.8; H2 -11.6,6.8; H3 -10.8,6.8; H4 -10,6.8; H5 -9.2,6.8; H6 -8.4,6.8; H7 -7.6,6.8; H8 -6.8,6.8; H9 -6,6.8; H10 -5.2,6.8; H11 -4.4,6.8; H12 -3.6,6.8; H13 -2.8,6.8; H14 -2,6.8; H15 -1.2,6.8; H16 -0.4,6.8; H17 0.4,6.8; H18 1.2,6.8; H19 2,6.8; H20 2.8,6.8; H21 3.6,6.8; H22 4.4,6.8; H23 5.2,6.8; H24 6,6.8; H25 6.8,6.8; H26 7.6,6.8; H27 8.4,6.8; H28 9.2,6.8; H29 10,6.8; H30 10.8,6.8; H31 11.6,6.8; H32 12.4,6.8; J1 -12.4,6; J2 -11.6,6; J3 -10.8,6; J4 -10,6; J5 -9.2,6; J6 -8.4,6; J8 -6.8,6; J10 -5.2,6; J12 -3.6,6; J14 -2,6; J16 -0.4,6; J18 1.2,6; J20 2.8,6; J22 4.4,6; J24 6,6; J25 6.8,6; J26 7.6,6; J27 8.4,6; J28 9.2,6; J29 10,6; J30 10.8,6; J31 11.6,6; K1 -12.4,5.2; K2 -11.6,5.2; K3 -10.8,5.2; K4 -10,5.2; K5 -9.2,5.2; K6 -8.4,5.2; K7 -7.6,5.2; K8 -6.8,5.2; K9 -6,5.2; K10 -5.2,5.2; K11 -4.4,5.2; K12 -3.6,5.2; K13 -2.8,5.2; K14 -2,5.2; K15 -1.2,5.2; K16 -0.4,5.2; K17 0.4,5.2; K18 1.2,5.2; K19 2,5.2; K20 2.8,5.2; K21 3.6,5.2; K22 4.4,5.2; K23 5.2,5.2; K25 6.8,5.2; K26 7.6,5.2; K27 8.4,5.2; K28 9.2,5.2; K29 10,5.2; K30 10.8,5.2; K31 11.6,5.2; K32 12.4,5.2; L1 -12.4,4.4; L2 -11.6,4.4; L3 -10.8,4.4; L4 -10,4.4; L5 -9.2,4.4; L6 -8.4,4.4; L8 -6.8,4.4; L9 -6,4.4; L10 -5.2,4.4; L11 -4.4,4.4; L12 -3.6,4.4; L13 -2.8,4.4; L14 -2,4.4; L15 -1.2,4.4; L16 -0.4,4.4; L17 0.4,4.4; L18 1.2,4.4; L19 2,4.4; L20 2.8,4.4; L21 3.6,4.4; L22 4.4,4.4; L23 5.2,4.4; L24 6,4.4; L25 6.8,4.4; L26 7.6,4.4; L27 8.4,4.4; L28 9.2,4.4; L29 10,4.4; L30 10.8,4.4; L31 11.6,4.4; L32 12.4,4.4; M1 -12.4,3.6; M2 -11.6,3.6; M3 -10.8,3.6; M4 -10,3.6; M5 -9.2,3.6; M6 -8.4,3.6; M7 -7.6,3.6; M8 -6.8,3.6; M9 -6,3.6; M10 -5.2,3.6; M11 -4.4,3.6; M12 -3.6,3.6; M13 -2.8,3.6; M14 -2,3.6; M15 -1.2,3.6; M16 -0.4,3.6; M17 0.4,3.6; M18 1.2,3.6; M19 2,3.6; M20 2.8,3.6; M21 3.6,3.6; M22 4.4,3.6; M23 5.2,3.6; M25 6.8,3.6; M26 7.6,3.6; M27 8.4,3.6; M28 9.2,3.6; M29 10,3.6; M30 10.8,3.6; M31 11.6,3.6; N1 -12.4,2.8; N2 -11.6,2.8; N3 -10.8,2.8; N4 -10,2.8; N5 -9.2,2.8; N6 -8.4,2.8; N8 -6.8,2.8; N9 -6,2.8; N10 -5.2,2.8; N11 -4.4,2.8; N12 -3.6,2.8; N13 -2.8,2.8; N14 -2,2.8; N15 -1.2,2.8; N16 -0.4,2.8; N17 0.4,2.8; N18 1.2,2.8; N19 2,2.8; N20 2.8,2.8; N21 3.6,2.8; N22 4.4,2.8; N23 5.2,2.8; N24 6,2.8; N25 6.8,2.8; N26 7.6,2.8; N27 8.4,2.8; N28 9.2,2.8; N29 10,2.8; N30 10.8,2.8; N31 11.6,2.8; N32 12.4,2.8; P1 -12.4,2; P2 -11.6,2; P3 -10.8,2; P4 -10,2; P5 -9.2,2; P6 -8.4,2; P7 -7.6,2; P8 -6.8,2; P9 -6,2; P10 -5.2,2; P11 -4.4,2; P12 -3.6,2; P13 -2.8,2; P14 -2,2; P15 -1.2,2; P16 -0.4,2; P17 0.4,2; P18 1.2,2; P19 2,2; P20 2.8,2; P21 3.6,2; P22 4.4,2; P23 5.2,2; P25 6.8,2; P26 7.6,2; P27 8.4,2; P28 9.2,2; P29 10,2; P30 10.8,2; P31 11.6,2; P32 12.4,2; R1 -12.4,1.2; R2 -11.6,1.2; R3 -10.8,1.2; R4 -10,1.2; R5 -9.2,1.2; R6 -8.4,1.2; R8 -6.8,1.2; R9 -6,1.2; R10 -5.2,1.2; R11 -4.4,1.2; R12 -3.6,1.2; R13 -2.8,1.2; R14 -2,1.2; R15 -1.2,1.2; R16 -0.4,1.2; R17 0.4,1.2; R18 1.2,1.2; R19 2,1.2; R20 2.8,1.2; R21 3.6,1.2; R22 4.4,1.2; R23 5.2,1.2; R24 6,1.2; R25 6.8,1.2; R26 7.6,1.2; R27 8.4,1.2; R28 9.2,1.2; R29 10,1.2; R30 10.8,1.2; R31 11.6,1.2; T1 -12.4,0.4; T2 -11.6,0.4; T3 -10.8,0.4; T4 -10,0.4; T5 -9.2,0.4; T6 -8.4,0.4; T7 -7.6,0.4; T8 -6.8,0.4; T9 -6,0.4; T10 -5.2,0.4; T11 -4.4,0.4; T12 -3.6,0.4; T13 -2.8,0.4; T14 -2,0.4; T15 -1.2,0.4; T16 -0.4,0.4; T17 0.4,0.4; T18 1.2,0.4; T19 2,0.4; T20 2.8,0.4; T21 3.6,0.4; T22 4.4,0.4; T23 5.2,0.4; T25 6.8,0.4; T26 7.6,0.4; T27 8.4,0.4; T28 9.2,0.4; T29 10,0.4; T30 10.8,0.4; T31 11.6,0.4; T32 12.4,0.4; U1 -12.4,-0.4; U2 -11.6,-0.4; U3 -10.8,-0.4; U4 -10,-0.4; U5 -9.2,-0.4; U6 -8.4,-0.4; U8 -6.8,-0.4; U9 -6,-0.4; U10 -5.2,-0.4; U11 -4.4,-0.4; U12 -3.6,-0.4; U13 -2.8,-0.4; U14 -2,-0.4; U15 -1.2,-0.4; U16 -0.4,-0.4; U17 0.4,-0.4; U18 1.2,-0.4; U19 2,-0.4; U20 2.8,-0.4; U21 3.6,-0.4; U22 4.4,-0.4; U23 5.2,-0.4; U24 6,-0.4; U25 6.8,-0.4; U26 7.6,-0.4; U27 8.4,-0.4; U28 9.2,-0.4; U29 10,-0.4; U30 10.8,-0.4; U31 11.6,-0.4; U32 12.4,-0.4; V1 -12.4,-1.2; V2 -11.6,-1.2; V3 -10.8,-1.2; V4 -10,-1.2; V5 -9.2,-1.2; V6 -8.4,-1.2; V7 -7.6,-1.2; V8 -6.8,-1.2; V9 -6,-1.2; V10 -5.2,-1.2; V11 -4.4,-1.2; V12 -3.6,-1.2; V13 -2.8,-1.2; V14 -2,-1.2; V15 -1.2,-1.2; V16 -0.4,-1.2; V17 0.4,-1.2; V18 1.2,-1.2; V19 2,-1.2; V20 2.8,-1.2; V21 3.6,-1.2; V22 4.4,-1.2; V23 5.2,-1.2; V25 6.8,-1.2; V26 7.6,-1.2; V27 8.4,-1.2; V28 9.2,-1.2; V29 10,-1.2; V30 10.8,-1.2; V31 11.6,-1.2; W1 -12.4,-2; W2 -11.6,-2; W3 -10.8,-2; W4 -10,-2; W5 -9.2,-2; W6 -8.4,-2; W8 -6.8,-2; W9 -6,-2; W10 -5.2,-2; W11 -4.4,-2; W12 -3.6,-2; W13 -2.8,-2; W14 -2,-2; W15 -1.2,-2; W16 -0.4,-2; W17 0.4,-2; W18 1.2,-2; W19 2,-2; W20 2.8,-2; W21 3.6,-2; W22 4.4,-2; W23 5.2,-2; W24 6,-2; W25 6.8,-2; W26 7.6,-2; W27 8.4,-2; W28 9.2,-2; W29 10,-2; W30 10.8,-2; W31 11.6,-2; W32 12.4,-2; Y1 -12.4,-2.8; Y2 -11.6,-2.8; Y3 -10.8,-2.8; Y4 -10,-2.8; Y5 -9.2,-2.8; Y6 -8.4,-2.8; Y7 -7.6,-2.8; Y8 -6.8,-2.8; Y9 -6,-2.8; Y10 -5.2,-2.8; Y11 -4.4,-2.8; Y12 -3.6,-2.8; Y13 -2.8,-2.8; Y14 -2,-2.8; Y15 -1.2,-2.8; Y16 -0.4,-2.8; Y17 0.4,-2.8; Y18 1.2,-2.8; Y19 2,-2.8; Y20 2.8,-2.8; Y21 3.6,-2.8; Y22 4.4,-2.8; Y23 5.2,-2.8; Y25 6.8,-2.8; Y26 7.6,-2.8; Y27 8.4,-2.8; Y28 9.2,-2.8; Y29 10,-2.8; Y30 10.8,-2.8; Y31 11.6,-2.8; Y32 12.4,-2.8
USON6 = smd 0.3 x 0.52: 1 -0.5,-0.38 | smd 0.3 x 0.49: 2 0,-0.375; 3 0.5,-0.375; 4 0.5,0.375; 5 0,0.375; 6 -0.5,0.375
UQFN-16 = smd 0.7 x 0.2: 1 -0.75,0.6 | smd 0.6 x 0.2: 2 -0.8,0.2; 3 -0.8,-0.2; 4 -0.8,-0.6; 9 0.8,-0.6; 10 0.8,-0.2; 11 0.8,0.2; 12 0.8,0.6 | smd 0.2 x 0.6: 5 -0.6,-1.2; 6 -0.2,-1.2; 7 0.2,-1.2; 8 0.6,-1.2; 13 0.6,1.2; 14 0.2,1.2; 15 -0.2,1.2; 16 -0.6,1.2
DSBGA-4_YZV = smd 0.27 x 0.27: A1 -0.25,0.25; A2 0.25,0.25; B1 -0.25,-0.25; B2 0.25,-0.25
VQFN-48 = smd 0.6 x 0.24: 1 -3.4,2.75; 2 -3.4,2.25; 3 -3.4,1.75; 4 -3.4,1.25; 5 -3.4,0.75; 6 -3.4,0.25; 7 -3.4,-0.25; 8 -3.4,-0.75; 9 -3.4,-1.25; 10 -3.4,-1.75; 11 -3.4,-2.25; 12 -3.4,-2.75; 25 3.4,-2.75; 26 3.4,-2.25; 27 3.4,-1.75; 28 3.4,-1.25; 29 3.4,-0.75; 30 3.4,-0.25; 31 3.4,0.25; 32 3.4,0.75; 33 3.4,1.25; 34 3.4,1.75; 35 3.4,2.25; 36 3.4,2.75 | smd 0.24 x 0.6: 13 -2.75,-3.4; 14 -2.25,-3.4; 15 -1.75,-3.4; 16 -1.25,-3.4; 17 -0.75,-3.4; 18 -0.25,-3.4; 19 0.25,-3.4; 20 0.75,-3.4; 21 1.25,-3.4; 22 1.75,-3.4; 23 2.25,-3.4; 24 2.75,-3.4; 37 2.75,3.4; 38 2.25,3.4; 39 1.75,3.4; 40 1.25,3.4; 41 0.75,3.4; 42 0.25,3.4; 43 -0.25,3.4; 44 -0.75,3.4; 45 -1.25,3.4; 46 -1.75,3.4; 47 -2.25,3.4; 48 -2.75,3.4 | smd 4.1 x 4.1: 49 0,0
MFF2 = smd 0.71 x 0.51: 1 2.55,-1.905; 2 2.55,-0.635; 3 2.55,0.635; 4 2.55,1.905; 5 -2.55,1.905; 6 -2.55,0.635; 7 -2.55,-0.635; 8 -2.55,-1.905 | smd 3.6 x 3.7: 9 0,0
AUAV = smd 3.81 x 1.52: 1 -8,6.35; 2 -8,3.81; 3 -8,1.27; 4 -8,-1.27; 5 -8,-3.81; 6 -8,-6.35; 7 8,-6.35; 8 8,-3.81; 9 8,-1.27; 10 8,1.27; 11 8,3.81; 12 8,6.35
MAGI2C = smd 0.6 x 0.2: 1 -1.9,1.2; 2 -1.9,0.8; 3 -1.9,0.4; 4 -1.9,0; 5 -1.9,-0.4; 6 -1.9,-0.8; 7 -1.9,-1.2; 15 1.9,-1.2; 16 1.9,-0.8; 17 1.9,-0.4; 18 1.9,0; 19 1.9,0.4; 20 1.9,0.8; 21 1.9,1.2 | smd 0.2 x 0.6: 8 -1.2,-1.9; 9 -0.8,-1.9; 10 -0.4,-1.9; 11 0,-1.9; 12 0.4,-1.9; 13 0.8,-1.9; 14 1.2,-1.9; 22 1.2,1.9; 23 0.8,1.9; 24 0.4,1.9; 25 0,1.9; 26 -0.4,1.9; 27 -0.8,1.9; 28 -1.2,1.9 | smd 2.5 x 2.5: EXP 0,0
LGA-14L = smd 0.525 x 0.3: 1 -1.163,0.75; 2 -1.163,0.25; 3 -1.163,-0.25; 4 -1.163,-0.75; 8 1.163,-0.75; 9 1.163,-0.25; 10 1.163,0.25; 11 1.163,0.75 | smd 0.3 x 0.525: 5 -0.5,-0.912; 6 0,-0.912; 7 0.5,-0.912; 12 0.5,0.912; 13 0,0.912; 14 -0.5,0.912
LGA-24 = smd 0.2 x 0.25: 1 -1.38,1; 6 -1.38,-1; 13 1.38,-1; 18 1.38,1 | smd 0.4 x 0.25: 2 -1.28,0.6; 3 -1.28,0.2; 4 -1.28,-0.2; 5 -1.28,-0.6; 14 1.28,-0.6; 15 1.28,-0.2; 16 1.28,0.2; 17 1.28,0.6 | smd 0.25 x 0.2: 7 -1,-1.38; 12 1,-1.38; 19 1,1.38; 24 -1,1.38 | smd 0.25 x 0.4: 8 -0.6,-1.28; 9 -0.2,-1.28; 10 0.2,-1.28; 11 0.6,-1.28; 20 0.6,1.28; 21 0.2,1.28; 22 -0.2,1.28; 23 -0.6,1.28
LGA-16 = smd 0.45 x 0.3: 1 -1.225,1; 2 -1.225,0.5; 3 -1.225,0; 4 -1.225,-0.5; 5 -1.225,-1; 9 1.225,-1; 10 1.225,-0.5; 11 1.225,0; 12 1.225,0.5; 13 1.225,1 | smd 0.3 x 0.45: 6 -0.5,-1.225; 7 0,-1.225; 8 0.5,-1.225; 14 0.5,1.225; 15 0,1.225; 16 -0.5,1.225
BMI088 = smd 0.25 x 0.675: 1 -1.5,1.262; 2 -1,1.262; 3 -0.5,1.262; 4 0,1.262; 5 0.5,1.262; 6 1,1.262; 7 1.5,1.262; 9 1.5,-1.262; 10 1,-1.262; 11 0.5,-1.262; 12 0,-1.262; 13 -0.5,-1.262; 14 -1,-1.262; 15 -1.5,-1.262 | smd 0.675 x 0.25: 8 2.013,0; 16 -2.013,0
IHLP2020CZER220M11 = smd 1.905 x 2.79: P$1 -2.425,0; P$2 2.425,0
XAL4020 = smd 0.98 x 3.4: 1 -1.185,0; 2 1.185,0
XAL7030-472 = smd 1.58 x 6.5: 1 -2.26,0; 2 2.26,0
L0603 = smd 0.65 x 0.7: 1 -0.675,0; 2 0.675,0
1812CAN = smd 1 x 1.15: 1 -1.84,-0.865; 2 1.84,-0.865; 3 1.84,0.865; 4 -1.84,0.865
SEN-Z-F = smd 2.4 x 1.95: N -1.4,0; P 1.4,0 | smd 1.66 x 1.35: P$1 -1.03,0; P$3 1.03,0
SEN-XY-F = smd 0.6 x 1.2: P$1 -2.65,0; P$3 2.65,0 | smd 1.4 x 1.7: P$2 -2.9,0; P$4 2.9,0
LED-0603 = smd 0.8 x 0.8: A 0,-0.75; C 0,0.75
ZED-F9P = smd 0.8 x 1.5: 1 -7.15,-7.45; 2 -6.05,-7.45; 3 -4.95,-7.45; 4 -3.85,-7.45; 5 -2.75,-7.45; 6 -1.65,-7.45; 7 -0.55,-7.45; 8 0.55,-7.45; 9 1.65,-7.45; 10 2.75,-7.45; 11 3.85,-7.45; 12 4.95,-7.45; 13 6.05,-7.45; 14 7.15,-7.45; 28 7.15,7.45; 29 6.05,7.45; 30 4.95,7.45; 31 3.85,7.45; 32 2.75,7.45; 33 1.65,7.45; 34 0.55,7.45; 35 -0.55,7.45; 36 -1.65,7.45; 37 -2.75,7.45; 38 -3.85,7.45; 39 -4.95,7.45; 40 -6.05,7.45; 41 -7.15,7.45 | smd 1.5 x 0.8: 15 9.85,-6.6; 16 9.85,-5.5; 17 9.85,-4.4; 18 9.85,-3.3; 19 9.85,-2.2; 20 9.85,-1.1; 21 9.85,0; 22 9.85,1.1; 23 9.85,2.2; 24 9.85,3.3; 25 9.85,4.4; 26 9.85,5.5; 27 9.85,6.6; 42 -9.85,6.6; 43 -9.85,5.5; 44 -9.85,4.4; 45 -9.85,3.3; 46 -9.85,2.2; 47 -9.85,1.1; 48 -9.85,0; 49 -9.85,-1.1; 50 -9.85,-2.2; 51 -9.85,-3.3; 52 -9.85,-4.4; 53 -9.85,-5.5; 54 -9.85,-6.6 | smd 1.1 x 1.1: GND1 7.35,-5.25; GND2 5.25,-5.25; GND3 3.15,-5.25; GND4 1.05,-5.25; GND5 -1.05,-5.25; GND6 -3.15,-5.25; GND7 -5.25,-5.25; GND8 -7.35,-5.25; GND9 7.35,-3.15; GND10 5.25,-3.15; GND11 3.15,-3.15; GND12 1.05,-3.15; GND13 -1.05,-3.15; GND14 -3.15,-3.15; GND15 -5.25,-3.15; GND16 -7.35,-3.15; GND17 7.35,-1.05; GND18 5.25,-1.05; GND19 3.15,-1.05; GND20 1.05,-1.05; GND21 -1.05,-1.05; GND22 -3.15,-1.05; GND23 -5.25,-1.05; GND24 -7.35,-1.05; GND25 7.35,1.05; GND26 5.25,1.05; GND27 3.15,1.05; GND28 1.05,1.05; GND29 -1.05,1.05; GND30 -3.15,1.05; GND31 -5.25,1.05; GND32 -7.35,1.05; GND33 7.35,3.15; GND34 5.25,3.15; GND35 3.15,3.15; GND36 1.05,3.15; GND37 -1.05,3.15; GND38 -3.15,3.15; GND39 -5.25,3.15; GND40 -7.35,3.15; GND41 7.35,5.25; GND42 5.25,5.25; GND43 3.15,5.25; GND44 1.05,5.25; GND45 -1.05,5.25; GND46 -3.15,5.25; GND47 -5.25,5.25; GND48 -7.35,5.25
SARA = smd 0.8 x 1.5: 1 -11,-6.95; 2 -9.9,-6.95; 3 -8.8,-6.95; 4 -7.7,-6.95; 5 -6.6,-6.95; 6 -5.5,-6.95; 7 -4.4,-6.95; 8 -3.3,-6.95; 9 -2.2,-6.95; 10 -1.1,-6.95; 11 0,-6.95; 12 1.1,-6.95; 13 2.2,-6.95; 14 3.3,-6.95; 15 4.4,-6.95; 16 5.5,-6.95; 17 6.6,-6.95; 18 7.7,-6.95; 19 8.8,-6.95; 20 9.9,-6.95; 21 11,-6.95; 33 11,6.95; 34 9.9,6.95; 35 8.8,6.95; 36 7.7,6.95; 37 6.6,6.95; 38 5.5,6.95; 39 4.4,6.95; 40 3.3,6.95; 41 2.2,6.95; 42 1.1,6.95; 43 0,6.95; 44 -1.1,6.95; 45 -2.2,6.95; 46 -3.3,6.95; 47 -4.4,6.95; 48 -5.5,6.95; 49 -6.6,6.95; 50 -7.7,6.95; 51 -8.8,6.95; 52 -9.9,6.95; 53 -11,6.95 | smd 1.5 x 0.8: 22 11.95,-5.5; 23 11.95,-4.4; 24 11.95,-3.3; 25 11.95,-2.2; 26 11.95,-1.1; 27 11.95,0; 28 11.95,1.1; 29 11.95,2.2; 30 11.95,3.3; 31 11.95,4.4; 32 11.95,5.5; 54 -11.95,5.5; 56 -11.95,3.3; 58 -11.95,1.1; 59 -11.95,0; 60 -11.95,-1.1; 61 -11.95,-2.2; 62 -11.95,-3.3; 63 -11.95,-4.4; 64 -11.95,-5.5 | smd 1.5 x 0.9: 55 -11.95,4.4; 57 -11.95,2.2 | smd 1.1 x 1.1: 65 -10.25,-5.25; 66 -10.25,-3.15; 67 -10.25,-1.05; 68 -10.25,1.05; 69 -10.25,3.15; 70 -10.25,5.25; 71 -8.45,-5.25; 72 -8.45,-3.15; 73 -8.45,-1.05; 74 -8.45,1.05; 75 -8.45,3.15; 76 -8.45,5.25; 77 -6.65,-5.25; 78 -6.65,5.25; 79 -3.05,-5.25; 80 -3.05,5.25; 81 3.05,-5.25; 82 3.05,5.25; 83 6.65,-5.25; 84 6.65,5.25; 85 8.45,-5.25; 86 8.45,-3.15; 87 8.45,-1.05; 88 8.45,1.05; 89 8.45,3.15; 90 8.45,5.25; 91 10.25,-5.25; 92 10.25,-3.15; 93 10.25,-1.05; 94 10.25,1.05; 95 10.25,3.15; 96 10.25,5.25 | smd 0.6 x 0.6: P$1 -12.1,-7
9774050360R = smd 7.4 x 7.4: 1 0,0 | hole 4.4: 0,0
WA-SMSI_9774027151 = smd 6 x 6: 1 0,0 | hole 3.7: 0,0
PAD_SMD_5X1.25 = smd 1.25 x 5: 1 0,0
PAD_SMD_5X0.8 = smd 0.8 x 5: 1 0,0
PAD_SMD_5X1 = smd 1 x 5: 1 0,0
SO-8L = smd 0.82 x 0.41: 1 -2.75,1.905; 2 -2.75,0.635; 3 -2.75,-0.635; 4 -2.75,-1.905 | smd 4.14 x 4.061: 5 1.02,0 | smd 0.51 x 5: EP1 2.835,0 | smd 0.61 x 5.251: EP2 -0.035,0
SOT-523 = smd 0.4 x 0.51: 1 -0.5,-0.645; 2 0.5,-0.645; 3 0,0.645
SOT363 = smd 0.5 x 0.5: 1 -0.9,0.75; 3 -0.9,-0.75; 4 0.9,-0.75; 6 0.9,0.75 | smd 0.5 x 0.4: 2 -0.9,0; 5 0.9,0
SOT23-3 = smd 0.69 x 0.99: 1 -0.95,-1; 2 0.95,-1; 3 0,1
R0805 = smd 1.2 x 1.3: 1 -1.016,0; 2 1.016,0
R0603 = smd 0.8 x 0.8: 1 -0.762,0; 2 0.762,0
R0402 = smd 0.5 x 0.5: 1 -0.508,0; 2 0.508,0
R0201 = smd 0.4 x 0.4: 1 -0.381,0; 2 0.381,0
R1210 = smd 1.2 x 2.5: 1 -1.524,0; 2 1.524,0
749020112B = smd 0.89 x 1.65: 1 -6.985,-4.28; 2 -5.715,-4.28; 3 -4.445,-4.28; 4 -3.175,-4.28; 5 -1.905,-4.28; 6 -0.635,-4.28; 7 0.635,-4.28; 8 1.905,-4.28; 9 3.175,-4.28; 10 4.445,-4.28; 11 5.715,-4.28; 12 6.985,-4.28; 13 6.985,4.28; 14 5.715,4.28; 15 4.445,4.28; 16 3.175,4.28; 17 1.905,4.28; 18 0.635,4.28; 19 -0.635,4.28; 20 -1.905,4.28; 21 -3.175,4.28; 22 -4.445,4.28; 23 -5.715,4.28; 24 -6.985,4.28
PAD.02X.02 = smd 0.508 x 0.508: P$1 0,0
ECS-250-18-33Q-DS-TR3 = smd 1.3 x 1.1: 1 -1.15,-0.9; 2 1.15,-0.9; 3 1.15,0.9; 4 -1.15,0.9
ECS-2520MVQ = smd 0.9 x 0.8: 1 -0.925,-0.725; 2 0.925,-0.725; 3 0.95,0.725; 4 -0.925,0.725